# EasyEDA Pro project ProProject_aDataFlow_v2_pub_2024-01-13.epro, schematic SCH_main_2.51
Create Date: 2023-10-16; Page Name: P1; Project Name: aDataFlow_v2_pub; Schematic Name: SCH_main_2.51; Update Date: 2024-01-03; Company: AMAGSTY; Drawed: amagsty; Page Size: A3; Part Number: -; Reviewed: -; Version: 2.51
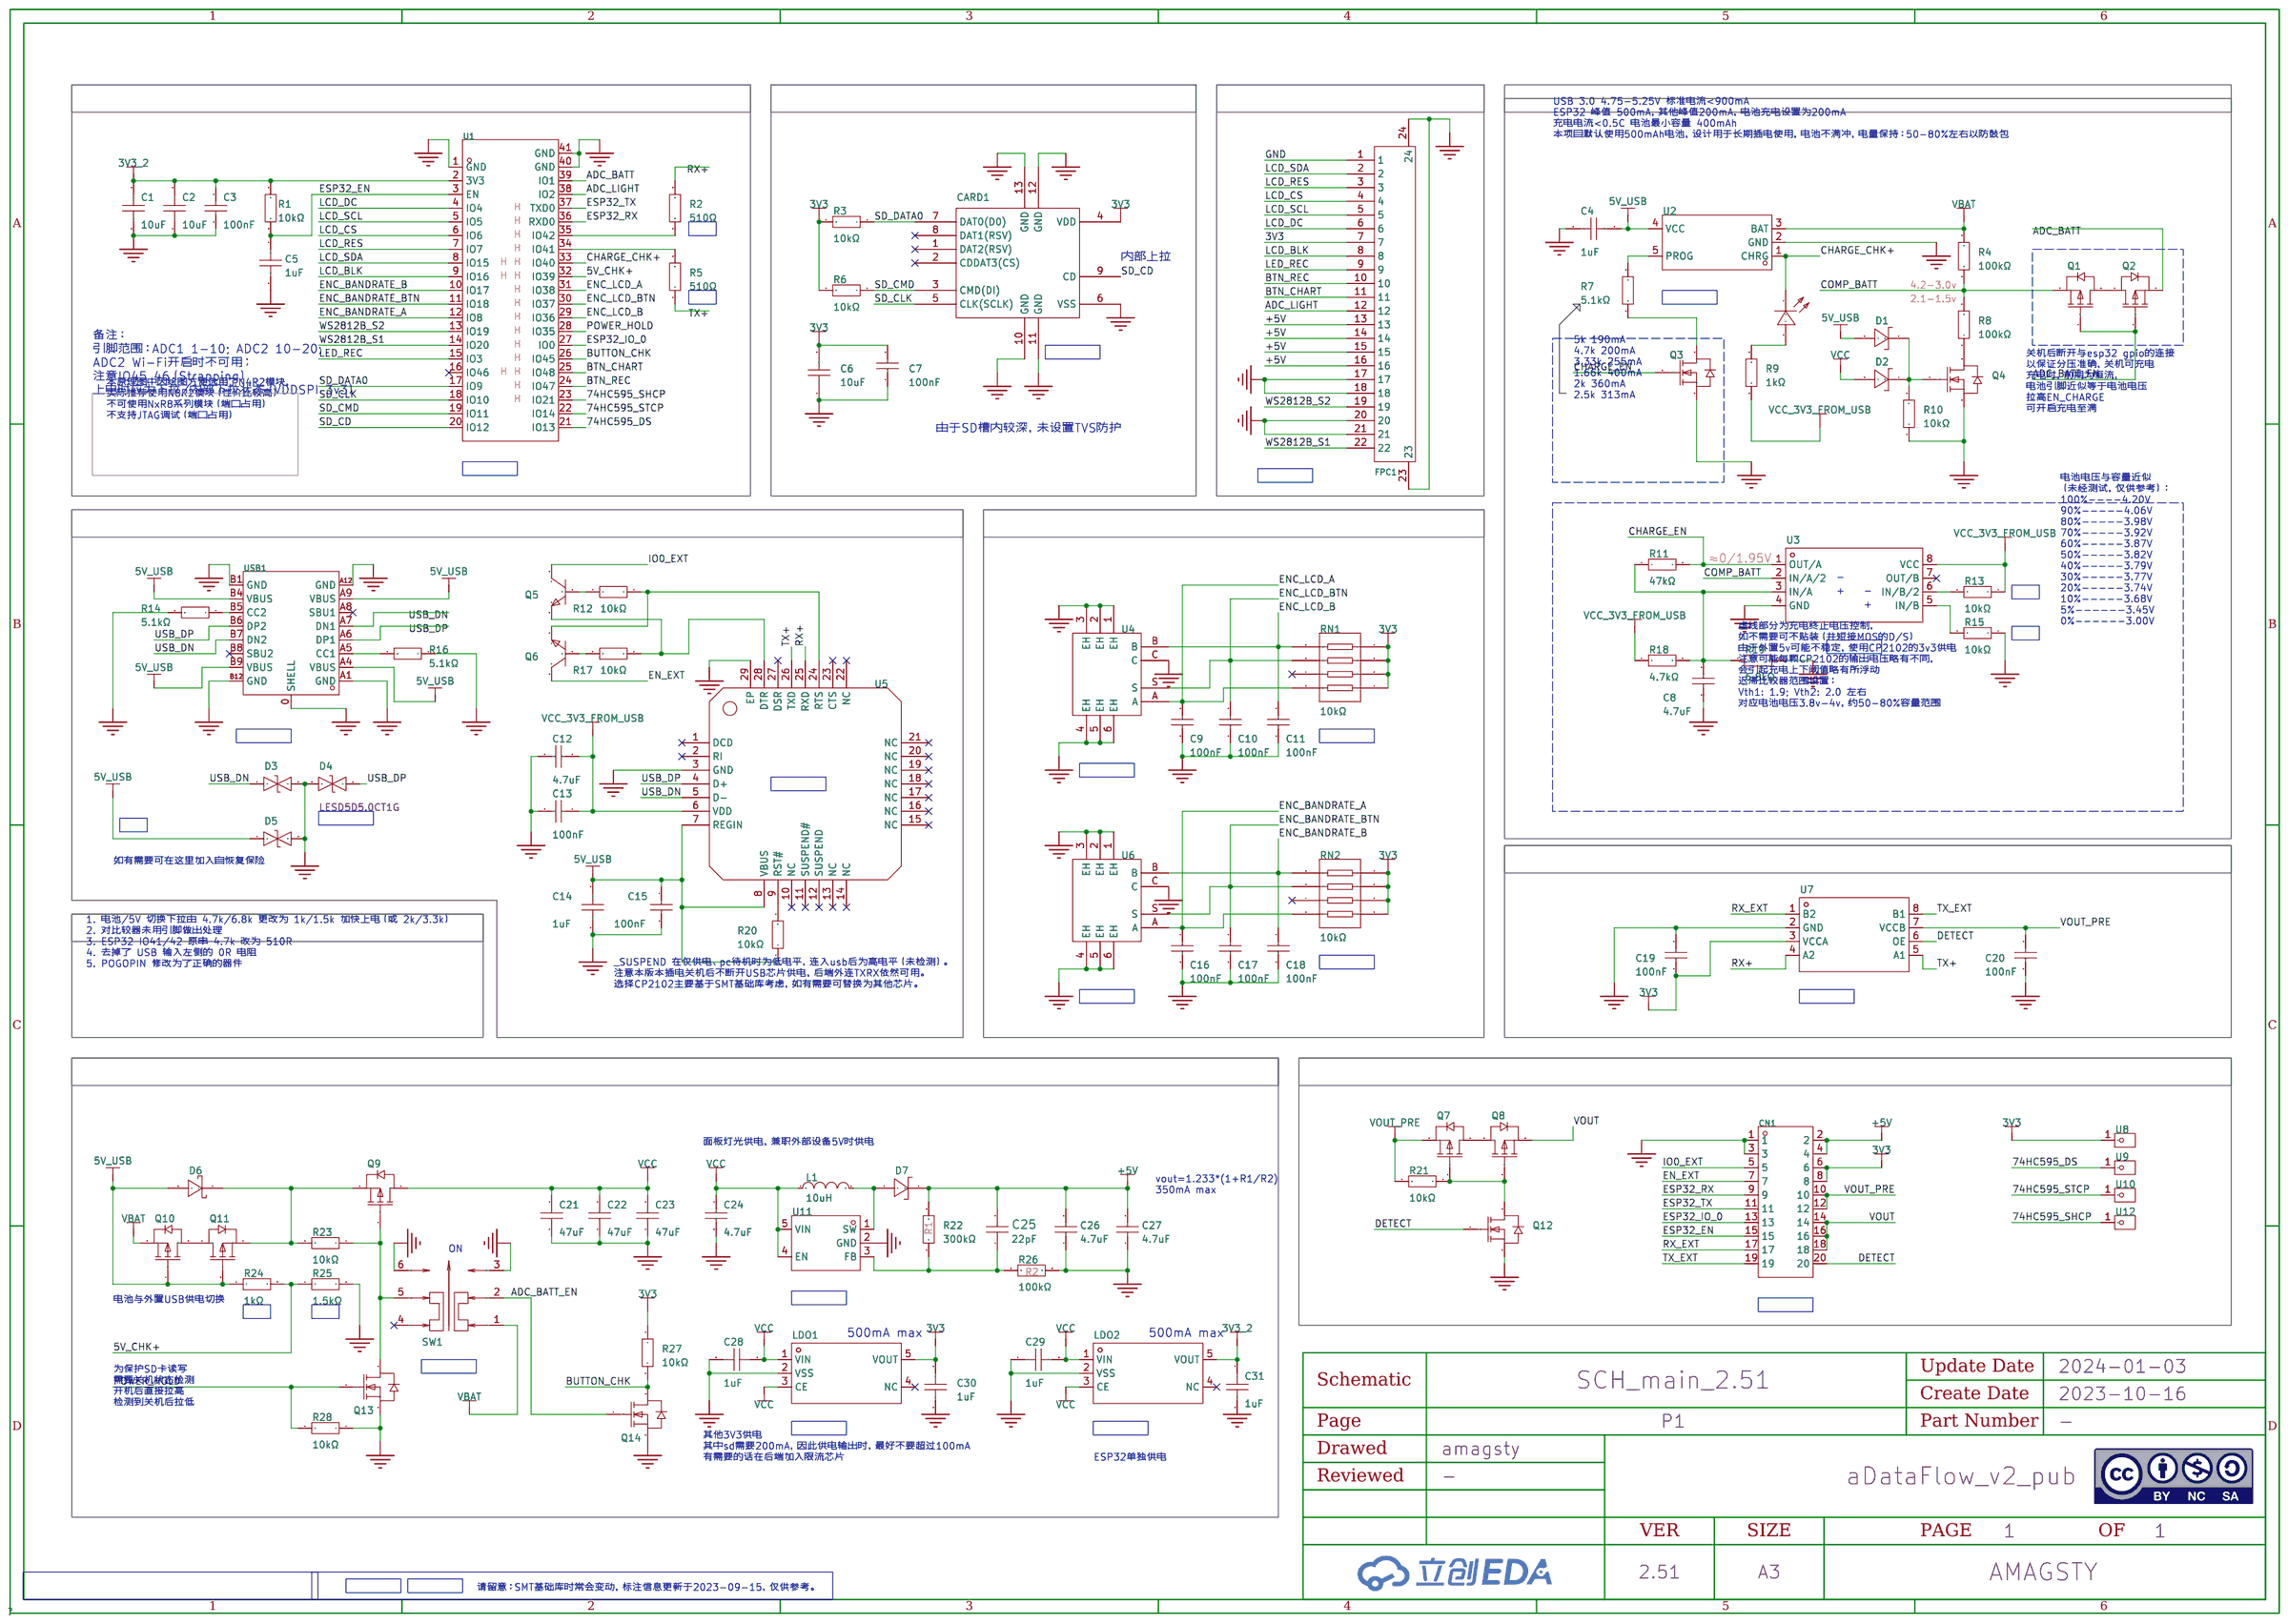
[diagram p3: schematic sheet]

## Parts
C1  10uF  [C0603]
C2  10uF  [C0603]
C3  100nF  [C0402]
C4  1uF  [C0402]
C5  1uF  [C0402]
C6  10uF  [C0603]
C7  100nF  [C0402]
C8  4.7uF  [C0402]
C9  100nF  [C0402]
C10  100nF  [C0402]
C11  100nF  [C0402]
C12  4.7uF  [C0402]
C13  100nF  [C0402]
C14  1uF  [C0402]
C15  100nF  [C0402]
C16  100nF  [C0402]
C17  100nF  [C0402]
C18  100nF  [C0402]
C19  100nF  [C0402]
C20  100nF  [C0402]
C21  47uF  [C0805]
C22  47uF  [C0805]
C23  47uF  [C0805]
C24  4.7uF  [C0402]
C25  22pF  [C0402]
C26  4.7uF  [C0402]
C27  4.7uF  [C0402]
C28  1uF  [C0402]
C29  1uF  [C0402]
C30  1uF  [C0402]
C31  1uF  [C0402]
CARD1  TF-01A  [TF-SMD_TF-01A]
CN1  X0509WVS-20AS-LPV01  [CONN-SMD_20P-P0.50_XKB_X0509WVS-20ADS-LPV01]
D1  1N5819WS  [SOD-323_L1.8-W1.3-LS2.5-RD]
D2  1N5819WS  [SOD-323_L1.8-W1.3-LS2.5-RD]
D3  LESD5D5.0CT1G  [SOD-523_L1.2-W0.8-LS1.6-BI]
D4  LESD5D5.0CT1G  [SOD-523_L1.2-W0.8-LS1.6-BI]
D5  LESD5D5.0CT1G  [SOD-523_L1.2-W0.8-LS1.6-BI]
D6  B5819W SL  [SOD-123_L2.7-W1.6-LS3.7-RD-1]
D7  1N5819WS  [SOD-323_L1.8-W1.3-LS2.5-RD]
FPC1  AFC01-S22FCA-00  [FPC-SMD_P0.5-22P_FGS-XJ-H2.0]
L1  10uH  [IND-SMD_L3.0-W3.0_SWPA3010S]
LDO1  ME6211C33M5G-N  [SOT-23-5_L3.0-W1.7-P0.95-LS2.8-BL]
LDO2  ME6211C33M5G-N  [SOT-23-5_L3.0-W1.7-P0.95-LS2.8-BL]
LED1  KT-0603R  [LED0603-RD]
Q1  AO3401A  [SOT-23_L2.9-W1.3-P1.90-LS2.4-BR]
Q2  AO3401A  [SOT-23_L2.9-W1.3-P1.90-LS2.4-BR]
Q3  AO3400A  [SOT-23-3_L2.9-W1.6-P1.90-LS2.8-BR]
Q4  AO3400A  [SOT-23-3_L2.9-W1.6-P1.90-LS2.8-BR]
Q5  SS8050  [SOT-23-3_L2.9-W1.3-P1.90-LS2.4-BR]
Q6  SS8050  [SOT-23-3_L2.9-W1.3-P1.90-LS2.4-BR]
Q7  AO3401A  [SOT-23_L2.9-W1.3-P1.90-LS2.4-BR]
Q8  AO3401A  [SOT-23_L2.9-W1.3-P1.90-LS2.4-BR]
Q9  AO3401A  [SOT-23_L2.9-W1.3-P1.90-LS2.4-BR]
Q10  AO3401A  [SOT-23_L2.9-W1.3-P1.90-LS2.4-BR]
Q11  AO3401A  [SOT-23_L2.9-W1.3-P1.90-LS2.4-BR]
Q12  AO3400A  [SOT-23-3_L2.9-W1.6-P1.90-LS2.8-BR]
Q13  AO3400A  [SOT-23-3_L2.9-W1.6-P1.90-LS2.8-BR]
Q14  AO3400A  [SOT-23-3_L2.9-W1.6-P1.90-LS2.8-BR]
R1  10kΩ  [R0402]
R2  510Ω  [R0402]
R3  10kΩ  [R0402]
R4  100kΩ  [R0402]
R5  510Ω  [R0402]
R6  10kΩ  [R0402]
R7  5.1kΩ  [R0402]
R8  100kΩ  [R0402]
R9  1kΩ  [R0402]
R10  10kΩ  [R0402]
R11  47kΩ  [R0402]
R12  10kΩ  [R0402]
R13  10kΩ  [R0402]
R14  5.1kΩ  [R0402]
R15  10kΩ  [R0402]
R16  5.1kΩ  [R0402]
R17  10kΩ  [R0402]
R18  4.7kΩ  [R0402]
R19  6.8kΩ  [R0402]
R20  10kΩ  [R0402]
R21  10kΩ  [R0402]
R22  300kΩ  [R0402]
R23  10kΩ  [R0402]
R24  1kΩ  [R0402]
R25  1.5kΩ  [R0402]
R26  100kΩ  [R0402]
R27  10kΩ  [R0402]
R28  10kΩ  [R0402]
RN1  10kΩ  [RES-ARRAY-SMD_0402-8P-L2.0-W1.0-BL]
RN2  10kΩ  [RES-ARRAY-SMD_0402-8P-L2.0-W1.0-BL]
SW1  XKB5858-Z-TP-75  [SW-SMD_6P-L5.8-W5.8-P2.00-LS8.3]
U1  ESP32-S3-WROOM-1U-N4R2  [WIRELM-SMD_ESP32-S3-WROOM-1U]
U2  TP4054-42-SOT25R  [SOT-23-5_L3.0-W1.7-P0.95-LS2.8-BL]
U3  LM393DR2G  [SOIC-8_L5.0-W4.0-P1.27-LS6.0-BL]
U4  SIQ-02FVS3  [SW-SMD_SIQ-02FVS3_1]
U5  CP2102-GMR  [WQFN-28_L5.0-W5.0-P0.50-BL-EP3.2]
U6  SIQ-02FVS3  [SW-SMD_SIQ-02FVS3_1]
U7  TXS0102DCUR  [VSON8_L2.0-W2.3-P0.50-LS3.1-BL]
U8  YTC1P-4020-01  [TESTPOINT-SMD_BD2.0_YTC1P-4020-01]
U9  YTC1P-4020-01  [TESTPOINT-SMD_BD2.0_YTC1P-4020-01]
U10  YTC1P-4020-01  [TESTPOINT-SMD_BD2.0_YTC1P-4020-01]
U11  TPS61040DBVR  [SOT-23-5_L3.0-W1.7-P0.95-LS2.8-BL]
U12  YTC1P-4020-01  [TESTPOINT-SMD_BD2.0_YTC1P-4020-01]
USB1  GT-USB-7051A  [USB-C-SMD_GT-USB-7051A]

## Library data of the parts
C1 C2 C6 = CL10A106KP8NNNC: 容值:10uF;精度:±10%;额定电压:10V;材质(温度系数):X5R;; LCSC Part Name: 10uF ±10% 10V; Supplier Part: C19702; Manufacturer: SAMSUNG(三星); Supplier Footprint: 0603; JLCPCB Part Class: 基础库; Datasheet: https://atta.szlcsc.com/upload/public/pdf/source/20160103/1457707703378.pdf; Supplier: LCSC; Tolerance: ±10%; Voltage Rated: 10V; Temperature Coefficient: X5R
C3 C7 C9-C11 C13 C15-C20 = CL05B104KO5NNNC: 容值:100nF;精度:±10%;额定电压:16V;材质(温度系数):X7R;; LCSC Part Name: 100nF ±10% 16V; Supplier Part: C1525; Manufacturer: SAMSUNG(三星); Supplier Footprint: 0402; JLCPCB Part Class: 基础库; Datasheet: https://atta.szlcsc.com/upload/public/pdf/source/20160103/1457707674891.pdf; Supplier: LCSC; Tolerance: ±10%; Voltage Rated: 16V; Temperature Coefficient: X7R
C4 C5 C14 C28-C31 = CL05A105KA5NQNC: 容值:1uF;精度:±10%;额定电压:25V;材质(温度系数):X5R;; LCSC Part Name: 1uF ±10% 25V; Supplier Part: C52923; Manufacturer: SAMSUNG(三星); Supplier Footprint: 0402; JLCPCB Part Class: 基础库; Datasheet: https://atta.szlcsc.com/upload/public/pdf/source/20160103/1457707735223.pdf; Supplier: LCSC; Tolerance: ±10%; Voltage Rated: 25V; Temperature Coefficient: X5R
C8 C12 C24 C26 C27 = CL05A475MP5NRNC: 容值:4.7uF;精度:±20%;额定电压:10V;材质(温度系数):X5R;; LCSC Part Name: 4.7uF ±20% 10V; Supplier Part: C23733; Manufacturer: SAMSUNG(三星); Supplier Footprint: 0402; JLCPCB Part Class: 基础库; Datasheet: https://atta.szlcsc.com/upload/public/pdf/source/20160103/1457707710457.pdf; Supplier: LCSC; Tolerance: ±20%; Voltage Rated: 10V; Temperature Coefficient: X5R
C21-C23 = CL21A476MQYNNNE: 容值:47uF;精度:±20%;额定电压:6.3V;材质(温度系数):X5R;; LCSC Part Name: 47uF ±20% 6.3V; Supplier Part: C16780; Manufacturer: SAMSUNG(三星); Supplier Footprint: 0805; JLCPCB Part Class: 基础库; Datasheet: https://atta.szlcsc.com/upload/public/pdf/source/20160103/1457707690276.pdf; Supplier: LCSC; Tolerance: ±20%; Voltage Rated: 6.3V; Temperature Coefficient: X5R
C25 = 0402CG220J500NT: 容值:22pF;精度:±5%;额定电压:50V;材质(温度系数):C0G;; LCSC Part Name: 22pF ±5% 50V; Supplier Part: C1555; Manufacturer: FH(风华); Supplier Footprint: 0402; JLCPCB Part Class: 基础库; Datasheet: https://atta.szlcsc.com/upload/public/pdf/source/20200305/C486355_26A10D38EF8C2A5C37091D0039909270.pdf; Supplier: LCSC; Tolerance: ±5%; Voltage Rated: 50V; Temperature Coefficient: C0G
CARD1 = TF-01A_C91145: 工作温度范围:-;本体最大高度:-;触头镀层:-;连接器类型:卡座;卡类型:MicroSD卡(TF卡);焊接温度(最大值):-;触头材质:-;卡连接方式:自弹式;; Supplier Part: C91145; Manufacturer: 韩国韩荣; Supplier Footprint: SMD; JLCPCB Part Class: 扩展库; Datasheet: https://atta.szlcsc.com/upload/public/pdf/source/20190322/C91145_63CBD6FB4639A3A3EC6A9721F18AE0FB.pdf; Supplier: LCSC; Connector Type: 卡座; Card Type: MicroSD卡(TF卡); Card Connection Mode: 自弹式
CN1 = X0509WVS-20AS-LPV01: PIN总数:20P;间距:0.5mm;行数:2;公母:公;安装方式:立贴;额定电流:3A;工作温度范围:-25℃~+85℃;; LCSC Part Name: PIN：20P 间距0.5mm 公 立贴; Supplier Part: C2925323; Manufacturer: XKB Connectivity(中国星坤); Supplier Footprint: SMD,P=0.5mm; JLCPCB Part Class: 扩展库; Datasheet: https://atta.szlcsc.com/upload/public/pdf/source/20211215/E0979017241D2013F95DF4E235DD3998.pdf; Supplier: LCSC; Number of Pins: 20P; Pitch: 0.5mm; Number of Rows: 2; Gender: 公; Mounting Style: 立贴; Current Rating (Max): 3A; Operating Temperature Range: -25℃~+85℃
D1 D2 D7 = 1N5819WS_C191023: 直流反向耐压(Vr):40V;平均整流电流(Io):1A;正向压降(Vf):600mV@1A;; LCSC Part Name: 40V 1A 600mV@1A; Supplier Part: C191023; Manufacturer: Hottech(合科泰); Supplier Footprint: SOD-323; JLCPCB Part Class: 基础库; Datasheet: https://atta.szlcsc.com/upload/public/pdf/source/20220428/3CB86FD8D28D653594B4E35F9D5AEFD9.pdf; Supplier: LCSC; Reverse Voltage (Vr): 40V; Average Rectified Current (Io): 1A; Forward Voltage (Vf@If): 600mV@1A
D3-D5 = LESD5D5.0CT1G: 极性:双向;反向截止电压(Vrwm):5V;击穿电压(VBR):5.6V;钳位电压(Vc)@Ipp:18.6V;; LCSC Part Name: 双向ESD; Supplier Part: C383211; Manufacturer: LRC(乐山无线电); Supplier Footprint: SOD-523; JLCPCB Part Class: 扩展库; Datasheet: https://atta.szlcsc.com/upload/public/pdf/source/20190807/C383211_633DF4B4E2C161403226E5235FE33A1C.pdf; Supplier: LCSC; Polarity: 双向; Reverse Stand-Off Voltage (Vrwm): 5V; Breakdown Voltage (VBR): 5.6V; Peak Pulse Current(Ipp)@8/20us: 9.4A; Clamping Voltage@Ipp: 18.6V
D6 = B5819W SL: 直流反向耐压(Vr):40V;平均整流电流(Io):1A;正向压降(Vf):600mV@1A;; LCSC Part Name: 40V 1A 600mV@1A; Supplier Part: C8598; Manufacturer: CJ(江苏长电/长晶); Supplier Footprint: SOD-123; JLCPCB Part Class: Basic Part; Datasheet: https://atta.szlcsc.com/upload/public/pdf/source/20170217/1487301580783.pdf; Supplier: LCSC; Reverse Voltage (Vr): 40V; Average Rectified Current (Io): 1A; Forward Voltage (Vf@If): 600mV@1A
FPC1 = AFC01-S22FCA-00: 间距:0.5mm;触点数量:22;锁定特性:翻盖式;安装类型:卧贴;触点类型:下接;; LCSC Part Name: FPC 0.5MM 22P 翻盖式 H2.0mm 下接; Supplier Part: C262668; Manufacturer: JS(钜硕电子); Supplier Footprint: P=0.5mm; JLCPCB Part Class: 扩展库; Supplier: LCSC; Pitch: 0.5mm; Number of Contacts: 22; Locking Feature: 翻盖式; Mounting Type: 卧贴; Contact Type: 下接; Height Above Board: 2mm; FFC, FCB Thickness: 0.3mm~0.3mm
L1 = SWPA3015S100MT: 电感值:10uH;精度:±20%;额定电流:770mA;直流电阻(DCR):325mΩ;; LCSC Part Name: 10uH ±20% 770mA 325mΩ; Supplier Part: C45403; Manufacturer: Sunlord(顺络); Supplier Footprint: SMD; JLCPCB Part Class: 扩展库; Datasheet: https://atta.szlcsc.com/upload/public/pdf/source/20210916/AC798BA7E846B7D0B6818F45CD84DB0B.pdf; Supplier: LCSC; Tolerance: ±20%; Rated Current: 770mA; DC Resistance (DCR): 325mΩ
LDO1 LDO2 = ME6211C33M5G-N: 输出类型:固定;输出极性:正;最大输入电压:6V;输出电压:3.3V;输出电流:500mA;电源纹波抑制比(PSRR):70dB;; Supplier Part: C82942; Manufacturer: MICRONE(南京微盟); Supplier Footprint: SOT-23-5; JLCPCB Part Class: Extended Part; Datasheet: https://atta.szlcsc.com/upload/public/pdf/source/20170918/C82942_1505727073070976520.pdf; Supplier: LCSC; Output Type: 固定; Output Polarity: 正; Number of Outputs: 1; Maximum Input Voltage: 6V; Output Voltage: 3.3V; Dropout Voltage: 260mV@(200mA); Output Current: 500mA; Power Supply Rejection Ratio (PSRR): 70dB
LED1 = KT-0603R: 发光颜色:红灯;二极管配置:-;透镜颜色:-;主波长:-;色温:-;功率:-;发光角度:-;安装方式:-;工作温度:-40℃~+85℃;; LCSC Part Name: 0603 红灯 高亮; Supplier Part: C2286; Manufacturer: KENTO; Supplier Footprint: 0603; JLCPCB Part Class: 基础库; Datasheet: https://atta.szlcsc.com/upload/public/pdf/source/20160616/1466072038404.pdf; Supplier: LCSC; Emitted Color: 红灯; Operating Temperature: -40℃~+85℃
Q1 Q2 Q7-Q11 = AO3401A_C15127: 类型:P沟道;漏源电压(Vdss):30V;连续漏极电流(Id):4A;功率(Pd):1.4W;导通电阻(RDS(on)@Vgs,Id):44mΩ@10V,4.3A;; LCSC Part Name: P沟道 30V 4A; Supplier Part: C15127; Manufacturer: AOS; Supplier Footprint: SOT-23-3L; JLCPCB Part Class: Basic Part; Datasheet: https://atta.szlcsc.com/upload/public/pdf/source/20160507/1462613609053.pdf; Supplier: LCSC; Type: P沟道; Drain Source Voltage (Vdss): 30V; Continuous Drain Current (Id): 4A; Power Dissipation (Pd): 1.4W; Drain Source On Resistance (RDS(on)@Vgs,Id): 44mΩ@10V,4.3A; Gate Threshold Voltage (Vgs(th)@Id): 1.3V@250uA
Q3 Q4 Q12-Q14 = AO3400A_C20917: 类型:N沟道;漏源电压(Vdss):30V;连续漏极电流(Id):5.7A;功率(Pd):1.4W;导通电阻(RDS(on)@Vgs,Id):26.5mΩ@10V,5.7A;; LCSC Part Name: N沟道 30V 5.7A; Supplier Part: C20917; Manufacturer: AOS; Supplier Footprint: SOT-23-3L; JLCPCB Part Class: Basic Part; Datasheet: https://atta.szlcsc.com/upload/public/pdf/source/20140107/1457706668533.pdf; Supplier: LCSC; Type: N沟道; Drain Source Voltage (Vdss): 30V; Continuous Drain Current (Id): 5.7A; Power Dissipation (Pd): 1.4W; Drain Source On Resistance (RDS(on)@Vgs,Id): 26.5mΩ@10V,5.7A; Gate Threshold Voltage (Vgs(th)@Id): 1.5V@250uA
Q5 Q6 = SS8050_C2150: 晶体管类型:NPN;集射极击穿电压(Vceo):25V;集电极电流(Ic):1.5A;功率(Pd):300mW;直流电流增益(hFE@Ic,Vce):200@100mA,1V;; LCSC Part Name: NPN 25V 1.5A Y1 200-350; Supplier Part: C2150; Manufacturer: CJ(江苏长电/长晶); Supplier Footprint: SOT-23; JLCPCB Part Class: 基础库; Datasheet: https://atta.szlcsc.com/upload/public/pdf/source/20230322/AEE86F4B043774EFF80CAEA14A37D9E9.pdf; Supplier: LCSC; Transistor Type: NPN; Collector-Emitter Breakdown Voltage (Vceo): 25V; Collector Current (Ic): 1.5A; Power Dissipation (Pd): 300mW; Collector Cut-Off Current (Icbo): 100nA; Collector-Emitter Saturation Voltage (VCE(sat)@Ic,Ib): 500mV@800mA,80mA; DC Current Gain (hFE@Ic,Vce): 200@100mA,1V; Transition Frequency (fT): 100MHz; Operating Temperature: +150℃@(Tj)
R1 R3 R6 R10 R12 R13 R15 R17 R20 R21 R23 R27 R28 = 0402WGF1002TCE: 电阻类型:厚膜电阻;阻值:10kΩ;精度:±1%;功率:62.5mW;; LCSC Part Name: 10kΩ ±1% 62.5mW; Supplier Part: C25744; Manufacturer: UNI-ROYAL(厚声); Supplier Footprint: 0402; JLCPCB Part Class: 基础库; Datasheet: https://atta.szlcsc.com/upload/public/pdf/source/20200306/C422600_1E6D84923E4A46A82E41ADD87F860B5C.pdf; Supplier: LCSC; Type: 厚膜电阻; Tolerance: ±1%; Power(Watts): 62.5mW; Temperature Coefficient: ±100ppm/℃; Overload Voltage (Max): 50V; Operating Temperature Range: -55℃~+155℃
R2 R5 = 0402WGF5100TCE: 阻值:510Ω;精度:±1%;功率:62.5mW;温度系数:±100ppm/℃;电阻类型:厚膜电阻;; LCSC Part Name: 510Ω ±1% 62.5mW 厚膜电阻; Supplier Part: C25123; Manufacturer: UNI-ROYAL(厚声); Supplier Footprint: 0402; JLCPCB Part Class: 基础库; Datasheet: https://atta.szlcsc.com/upload/public/pdf/source/20200306/C422600_1E6D84923E4A46A82E41ADD87F860B5C.pdf; Supplier: LCSC; Tolerance: ±1%; Power(Watts): 62.5mW; Overload Voltage (Max): 50V; Temperature Coefficient: ±100ppm/℃; Type: 厚膜电阻; Operating Temperature Range: -55℃~+155℃
R4 R8 R26 = 0402WGF1003TCE: 电阻类型:厚膜电阻;阻值:100kΩ;精度:±1%;功率:62.5mW;; LCSC Part Name: 100kΩ ±1% 62.5mW; Supplier Part: C25741; Manufacturer: UNI-ROYAL(厚声); Supplier Footprint: 0402; JLCPCB Part Class: 基础库; Datasheet: https://atta.szlcsc.com/upload/public/pdf/source/20200306/C422600_1E6D84923E4A46A82E41ADD87F860B5C.pdf; Supplier: LCSC; Type: 厚膜电阻; Tolerance: ±1%; Power(Watts): 62.5mW; Temperature Coefficient: ±100ppm/℃; Overload Voltage (Max): 50V; Operating Temperature Range: -55℃~+155℃
R7 R14 R16 = 0402WGF5101TCE: 电阻类型:厚膜电阻;阻值:5.1kΩ;精度:±1%;功率:62.5mW;; LCSC Part Name: 5.1kΩ ±1% 62.5mW; Supplier Part: C25905; Manufacturer: UNI-ROYAL(厚声); Supplier Footprint: 0402; JLCPCB Part Class: Basic Part; Datasheet: https://atta.szlcsc.com/upload/public/pdf/source/20200306/C422600_1E6D84923E4A46A82E41ADD87F860B5C.pdf; Supplier: LCSC; Type: 厚膜电阻; Tolerance: ±1%; Power(Watts): 62.5mW; Temperature Coefficient: ±100ppm/℃; Overload Voltage (Max): 50V; Operating Temperature Range: -55℃~+155℃
R9 = 0402WGF1001TCE: 电阻类型:厚膜电阻;阻值:1kΩ;精度:±1%;功率:62.5mW;; LCSC Part Name: 1kΩ ±1% 62.5mW; Supplier Part: C11702; Manufacturer: UNI-ROYAL(厚声); Supplier Footprint: 0402; JLCPCB Part Class: 基础库; Datasheet: https://atta.szlcsc.com/upload/public/pdf/source/20200306/C422600_1E6D84923E4A46A82E41ADD87F860B5C.pdf; Supplier: LCSC; Type: 厚膜电阻; Tolerance: ±1%; Power(Watts): 62.5mW; Temperature Coefficient: ±100ppm/℃; Overload Voltage (Max): 50V; Operating Temperature Range: -55℃~+155℃
R11 = 0402WGF4702TCE: 电阻类型:厚膜电阻;阻值:47kΩ;精度:±1%;功率:62.5mW;; LCSC Part Name: 47kΩ ±1% 62.5mW; Supplier Part: C25792; Manufacturer: UNI-ROYAL(厚声); Supplier Footprint: 0402; JLCPCB Part Class: 基础库; Datasheet: https://atta.szlcsc.com/upload/public/pdf/source/20200306/C422600_1E6D84923E4A46A82E41ADD87F860B5C.pdf; Supplier: LCSC; Type: 厚膜电阻; Tolerance: ±1%; Power(Watts): 62.5mW; Temperature Coefficient: ±100ppm/℃; Overload Voltage (Max): 50V; Operating Temperature Range: -55℃~+155℃
R18 = 0402WGF4701TCE: 电阻类型:厚膜电阻;阻值:4.7kΩ;精度:±1%;功率:62.5mW;; LCSC Part Name: 4.7kΩ ±1% 62.5mW; Supplier Part: C25900; Manufacturer: UNI-ROYAL(厚声); Supplier Footprint: 0402; JLCPCB Part Class: 基础库; Datasheet: https://atta.szlcsc.com/upload/public/pdf/source/20200306/C422600_1E6D84923E4A46A82E41ADD87F860B5C.pdf; Supplier: LCSC; Type: 厚膜电阻; Tolerance: ±1%; Power(Watts): 62.5mW; Temperature Coefficient: ±100ppm/℃; Overload Voltage (Max): 50V; Operating Temperature Range: -55℃~+155℃
R19 = 0402WGF6801TCE: 电阻类型:厚膜电阻;阻值:6.8kΩ;精度:±1%;功率:62.5mW;; LCSC Part Name: 6.8kΩ ±1% 62.5mW; Supplier Part: C25917; Manufacturer: UNI-ROYAL(厚声); Supplier Footprint: 0402; JLCPCB Part Class: 基础库; Datasheet: https://atta.szlcsc.com/upload/public/pdf/source/20200306/C422600_1E6D84923E4A46A82E41ADD87F860B5C.pdf; Supplier: LCSC; Type: 厚膜电阻; Tolerance: ±1%; Power(Watts): 62.5mW; Temperature Coefficient: ±100ppm/℃; Overload Voltage (Max): 50V; Operating Temperature Range: -55℃~+155℃
R22 = 0402WGF3003TCE: 电阻类型:厚膜电阻;阻值:300kΩ;精度:±1%;功率:62.5mW;; LCSC Part Name: 300kΩ ±1% 62.5mW; Supplier Part: C25774; Manufacturer: UNI-ROYAL(厚声); Supplier Footprint: 0402; JLCPCB Part Class: 基础库; Datasheet: https://atta.szlcsc.com/upload/public/pdf/source/20200306/C422600_1E6D84923E4A46A82E41ADD87F860B5C.pdf; Supplier: LCSC; Type: 厚膜电阻; Tolerance: ±1%; Power(Watts): 62.5mW; Temperature Coefficient: ±100ppm/℃; Overload Voltage (Max): 50V; Operating Temperature Range: -55℃~+155℃
R24 = 0402WGF1001TCE: 阻值:1kΩ;精度:±1%;功率:62.5mW;温度系数:±100ppm/℃;电阻类型:厚膜电阻;; LCSC Part Name: 1kΩ ±1% 62.5mW 厚膜电阻; Supplier Part: C11702; Manufacturer: UNI-ROYAL(厚声); Supplier Footprint: 0402; JLCPCB Part Class: Basic Part; Datasheet: https://atta.szlcsc.com/upload/public/pdf/source/20200306/C422600_1E6D84923E4A46A82E41ADD87F860B5C.pdf; Supplier: LCSC; Type: 厚膜电阻; Tolerance: ±1%; Power(Watts): 62.5mW; Temperature Coefficient: ±100ppm/℃; Overload Voltage (Max): 50V; Operating Temperature Range: -55℃~+155℃
R25 = 0402WGF1501TCE: 阻值:1.5kΩ;精度:±1%;功率:62.5mW;温度系数:±100ppm/℃;电阻类型:厚膜电阻;; LCSC Part Name: 1.5kΩ ±1% 62.5mW 厚膜电阻; Supplier Part: C25867; Manufacturer: UNI-ROYAL(厚声); Supplier Footprint: 0402; JLCPCB Part Class: Basic Part; Datasheet: https://atta.szlcsc.com/upload/public/pdf/source/20200306/C422600_1E6D84923E4A46A82E41ADD87F860B5C.pdf; Supplier: LCSC; Tolerance: ±1%; Power(Watts): 62.5mW; Overload Voltage (Max): 50V; Temperature Coefficient: ±100ppm/℃; Type: 厚膜电阻; Operating Temperature Range: -55℃~+155℃
RN1 RN2 = 4D02WGJ0103TCE: 阻值:10kΩ;精度:±5%;单个元件功率:62.5mW;电阻器数:4;; LCSC Part Name: 10kΩ ±5%; Supplier Part: C25725; Manufacturer: UNI-ROYAL(厚声); Supplier Footprint: 0402x4; JLCPCB Part Class: 基础库; Datasheet: https://atta.szlcsc.com/upload/public/pdf/source/20170615/1497510998113.pdf; Supplier: LCSC; Tolerance: ±5%; Power(Watts): 62.5mW; Number of Resistors: 4; Number of Pins: 8; Temperature Coefficient: ±200ppm/℃
SW1 = XKB5858-Z-TP-75: 触点电流:100mA;额定电压 (AC):250V;额定电压 (DC):30V;绝缘电阻:100MΩ;安装方式:立贴;自锁/无锁:自锁;按键形状:方形按钮;按键/盖帽颜色:白色;带灯:无;引脚样式:SMD接片;作用力:160gf@±80gf;工作温度:-15℃~+55℃;机械寿命:100000;; LCSC Part Name: 按键开关5.8*按键开关5.8贴片自锁开关 平头; Supplier Part: C692487; Manufacturer: XKB Connectivity(中国星坤); Supplier Footprint: SMD; JLCPCB Part Class: Extended Part; Datasheet: https://atta.szlcsc.com/upload/public/pdf/source/20211011/C026329EEDA5FA5907D52CCCFB7A027C.pdf; Supplier: LCSC; Contact Current: 100mA; Voltage Rating (AC): 250V; Voltage Rating (DC): 30V; Insulation Resistance: 100MΩ; Mounting Style: 立贴; Self Lock / No Lock: 自锁; Actuator Style: 方形按钮; Actuator/Cap Color: 白色; With Lamp: 无; Pin Style: SMD接片; Operating Force: 160gf@±80gf; Operating Temperature: -15℃~+55℃; Mechanical Life: 100000
U1 = ESP32-S3-WROOM-1U-N4R2: LCSC Part Name: 通用型Wi-Fi+低功耗蓝牙MCU模组; Supplier Part: C3013942; Manufacturer: ESPRESSIF(乐鑫); Supplier Footprint: SMD,18x19.2mm; JLCPCB Part Class: Extended Part; Datasheet: https://atta.szlcsc.com/upload/public/pdf/source/20220628/A2AC12B3C87735CAEB7EBE2DBE80936C.pdf; Supplier: LCSC
U2 = TP4054-42-SOT25R: 锂电池充电管理芯片; Supplier Part: C32574; Manufacturer: TOPPOWER(南京拓微); Supplier Footprint: SOT-23-5; JLCPCB Part Class: Basic Part; Datasheet: https://atta.szlcsc.com/upload/public/pdf/source/20140621/1457707095588.pdf; Supplier: LCSC
U3 = LM393DR2G: 比较器组数:2;输入失调电压(Vos):5mV;输入偏置电流(Ib):250nA;; LCSC Part Name: 比较器，双，低偏移电压; Supplier Part: C7955; Manufacturer: onsemi(安森美); Supplier Footprint: SOIC-8; JLCPCB Part Class: 基础库; Datasheet: https://atta.szlcsc.com/upload/public/pdf/source/20140815/1457707223499.pdf; Supplier: LCSC; Number of Elements: 2; Input Offset Voltage (Vos): 5mV; Input Bias Current (Ib): 250nA; Supply Current: 2.5mA; Supply Voltage: 1V~18V；2V~36V; Operating Temperature: 0℃~+70℃
U4 U6 = SIQ-02FVS3: LCSC Part Name: 拨轮滚轮旋转编码器开关; Supplier Part: C2925423; Manufacturer: MITSUMI(美上美); Supplier Footprint: SMD; JLCPCB Part Class: Extended Part; Datasheet: https://atta.szlcsc.com/upload/public/pdf/source/20220728/2FBC1A98A06DC86460FC69DAE20456FC.pdf; Supplier: LCSC
U5 = CP2102-GMR: 类型:Transceiver;协议类别:USB;驱动器/接收器数:1/1;数据速率:1Mbps;; Supplier Part: C6568; Manufacturer: SILICON LABS(芯科); Supplier Footprint: QFN-28(5x5); JLCPCB Part Class: 基础库; Datasheet: https://atta.szlcsc.com/upload/public/pdf/source/20170103/1483439882795.pdf; Supplier: LCSC; Type: Transceiver; Protocol: USB; Number of Drivers/Receivers: 1/1; Data Rate: 1Mbps; Supply Voltage: 3V ~ 3.6V
U7 = TXS0102DCUR: 通道数:2;电压(VCCA):1.65V~3.6V;电压(VCCB):2.3V~5.5V;数据速率:24Mbps;; Supplier Part: C53434; Manufacturer: TI(德州仪器); Supplier Footprint: VSSOP-8; JLCPCB Part Class: Extended Part; Datasheet: https://atta.szlcsc.com/upload/public/pdf/source/20150713/1457707330008.pdf; Supplier: LCSC; Channel Type: 双向; Number of Channels: 2; Supply Voltage (VCCA): 1.65V~3.6V; Supply Voltage (VCCB): 2.3V~5.5V; Output Type: 开路漏极，推挽式; Data Rate: 24Mbps; Operating Temperature: -40℃~+85℃; Features: 自动方向检测
U8-U10 U12 = YTC1P-4020-01: 类型:弹簧顶针(POGO PIN);PIN位数:单PIN位;全长/全高:6mm;额定电流:2.5A;额定电压:12V;触头材质:黄铜;触头镀层:金;; LCSC Part Name: POGO PIN弹簧顶针 贴片连接器; Supplier Part: C5221284; Manufacturer: YIYUAN(怡远); JLCPCB Part Class: Extended Part; Datasheet: https://atta.szlcsc.com/upload/public/pdf/source/20221031/BD070516233C1C93A35D01CFB419D0D5.pdf; Supplier: LCSC; Type: 弹簧顶针(POGO PIN); Number of Pins: 单PIN位; Overall Length/Height: 6mm; Rated Current: 2.5A; Rated Voltage: 12V; Contact Material: 黄铜; Contact Plating: 金
U11 = TPS61040DBVR: 功能类型:升压型;输入电压:1.8V~6V;输出电压:28V;输出电流(最大值):350mA;; LCSC Part Name: 升压型 输入1.8V~6V 输出28V 350mA; Supplier Part: C7722; Manufacturer: TI(德州仪器); Supplier Footprint: SOT-23-5; JLCPCB Part Class: Basic Part; Datasheet: https://atta.szlcsc.com/upload/public/pdf/source/20140704/1457707110339.pdf; Supplier: LCSC; Function: 升压型; Synchronous Rectification: 否; Number of Outputs: 1; Topology: 升压式; Input Voltage: 1.8V~6V; Output Voltage: 28V; Output Current (Max): 350mA; Switching Frequency: 1MHz
USB1 = GT-USB-7051A: 连接器类型:Type-C;标准:USB 2.0;公母:母座;触点数量:16P;端口数量:1;安装方式:立贴;额定电流 - 电源:5A;触头材质:高导铜;触头镀层:金;工作温度范围:-40℃~+85℃;; LCSC Part Name: Type-C 母座 立贴; Supplier Part: C2843970; Manufacturer: G-Switch(品赞); Supplier Footprint: SMD; JLCPCB Part Class: 扩展库; Datasheet: https://atta.szlcsc.com/upload/public/pdf/source/20210708/C2843970_57A99E08470C2FD0100D7CD4530FE18A.pdf; Supplier: LCSC; Connector Type: Type-C; Standard: USB 2.0; Gender: 母座; Number of Contacts: 16P; Number of Ports: 1; Mounting Style: 立贴; Current Rating - Power (Max): 5A; Contact Material: 高导铜; Contact Plating: 金; Operating Temperature Range: -40℃~+85℃

## Nets
3V3: C6.2 C7.2 C19.1 C30.2 CARD1.4(VDD) CN1.6 CN1.8 FPC1.7 LDO1.5(VOUT) R3.2 R6.2 R27.1 RN1.1 RN1.2 RN1.3 RN1.4 RN2.1 RN2.2 RN2.3 RN2.4 U7.3(VCCA) U8.1
3V3_2: C1.2 C2.2 C3.2 C31.2 LDO2.5(VOUT) R1.2 U1.2(3V3)
5V_CHK+: R24.2 R25.1 U1.32(IO39)
5V_USB: C4.2 C14.1 C15.1 D1.2(A) D5.1 D6.2(+) Q10.1(G) Q11.1(G) R20.1 R24.1 U2.4(VCC) U5.7(REGIN) U5.8(VBUS) USB1.A4(VBUS) USB1.A9(VBUS) USB1.B4(VBUS) USB1.B9(VBUS)
+5V: C25.2 C26.2 C27.2 CN1.2 CN1.4 D7.1(C) FPC1.13 FPC1.14 FPC1.15 FPC1.16 R22.2
GND: C1.1 C2.1 C3.1 C4.1 C5.2 C6.1 C7.1 C8.2 C9.2 C10.2 C11.2 C12.2 C13.2 C14.2 C15.2 C16.2 C17.2 C18.2 C19.2 C20.1 C21.1 C22.1 C23.1 C24.1 C26.1 C27.1 C28.2 C29.2 C30.1 C31.1 CARD1.6(VSS) CARD1.10(GND) CARD1.11(GND) CARD1.12(GND) CARD1.13(GND) CN1.1 CN1.3 D3.2 D4.2 D5.2 FPC1.1 FPC1.17 FPC1.18 FPC1.20 FPC1.21 FPC1.23 FPC1.24 LDO1.2(VSS) LDO2.2(VSS) Q3.2(S) Q4.2(S) Q12.2(S) Q13.2(S) Q14.2(S) R10.1 R14.2 R15.1 R16.1 R19.2 R25.2 R26.2 R28.1 SW1.3 SW1.6 U1.1(GND) U1.40(GND) U1.41(GND) U2.2(GND) U3.4(GND) U4.1(EH) U4.2(EH) U4.3(EH) U4.4(EH) U4.5(EH) U4.6(EH) U4.C U5.3(GND) U5.29(EP) U6.1(EH) U6.2(EH) U6.3(EH) U6.4(EH) U6.5(EH) U6.6(EH) U6.C U7.2(GND) U11.2(GND) USB1.0(SHELL) USB1.A1(GND) USB1.A12(GND) USB1.B1(GND) USB1.B12(GND)
VBAT: Q10.2(S) R4.2 SW1.1 U2.3(BAT)
VCC: C21.2 C22.2 C23.2 C24.2 C28.1 C29.1 D2.2(A) L1.1 LDO1.1(VIN) LDO1.3(CE) LDO2.1(VIN) LDO2.3(CE) Q9.3(D) U11.4(EN) U11.5(VIN)
VCC_3V3_FROM_USB: C12.1 C13.1 R9.1 R13.1 R18.1 U3.8(VCC) U5.6(VDD)
74HC595_DS: U1.21(IO13) U9.1
74HC595_SHCP: U1.23(IO21) U12.1
74HC595_STCP: U1.22(IO14) U10.1
ADC_BATT: Q2.2(S) U1.39(IO1)
ADC_BATT_EN: Q1.1(G) Q2.1(G) Q14.1(G) SW1.2
ADC_LIGHT: FPC1.12 U1.38(IO2)
BTN_CHART: FPC1.11 U1.25(IO48)
BTN_REC: FPC1.10 U1.24(IO47)
BUTTON_CHK: Q14.3(D) R27.2 U1.26(IO45)
CHARGE_CHK+: LED1.1(K) U1.33(IO40) U2.1(CHRG)
CHARGE_EN: Q3.1(G) R11.2 U3.1(OUT/A)
COMP_BATT: Q1.2(S) R4.1 R8.2 U3.2(IN/A/2)
DETECT: CN1.20 Q12.1(G) U7.6(OE)
EN_EXT: CN1.7 Q6.3(C)
ENC_BANDRATE_A: C16.1 RN2.8 U1.12(IO8) U6.A
ENC_BANDRATE_B: C18.1 RN2.5 U1.10(IO17) U6.B
ENC_BANDRATE_BTN: C17.1 RN2.6 U1.11(IO18) U6.S
ENC_LCD_A: C9.1 RN1.8 U1.31(IO38) U4.A
ENC_LCD_B: C11.1 RN1.5 U1.29(IO36) U4.B
ENC_LCD_BTN: C10.1 RN1.6 U1.30(IO37) U4.S
ESP32_EN: C5.1 CN1.15 R1.1 U1.3(EN)
ESP32_IO_0: CN1.13 U1.27(IO0)
ESP32_RX: CN1.9 U1.36(RXD0)
ESP32_TX: CN1.11 U1.37(TXD0)
IO0_EXT: CN1.5 Q5.3(C)
LCD_BLK: FPC1.8 U1.9(IO16)
LCD_CS: FPC1.4 U1.6(IO6)
LCD_DC: FPC1.6 U1.4(IO4)
LCD_RES: FPC1.3 U1.7(IO7)
LCD_SCL: FPC1.5 U1.5(IO5)
LCD_SDA: FPC1.2 U1.8(IO15)
LED_REC: FPC1.9 U1.15(IO3)
POWER_HOLD: Q13.1(G) R28.2 U1.28(IO35)
RX+: R2.2 U5.25(RXD) U7.4(A2)
RX_EXT: CN1.17 U7.1(B2)
SD_CD: CARD1.9(CD) U1.20(IO12)
SD_CLK: CARD1.5(CLK(SCLK)) U1.18(IO10)
SD_CMD: CARD1.3(CMD(DI)) R6.1 U1.19(IO11)
SD_DATA0: CARD1.7(DAT0(D0)) R3.1 U1.17(IO9)
TX+: R5.1 U5.26(TXD) U7.5(A1)
TX_EXT: CN1.19 U7.8(B1)
USB_DN: D3.1 U5.5(D-) USB1.A7(DN1) USB1.B7(DN2)
USB_DP: D4.1 U5.4(D+) USB1.A6(DP1) USB1.B6(DP2)
VOUT: CN1.14 CN1.16 CN1.18 Q8.2(S)
VOUT_PRE: C20.2 CN1.10 CN1.12 Q7.2(S) R21.2 U7.7(VCCB)
WS2812B_S1: FPC1.22 U1.14(IO20)
WS2812B_S2: FPC1.19 U1.13(IO19)
$1N2499: D6.1(-) Q9.2(S) Q11.2(S) R23.2
$1N3893: Q10.3(D) Q11.3(D)
$1N5725: D7.2(A) L1.2 U11.1(SW)
$1N6186: C25.1 R22.1 R26.1 U11.3(FB)
$1N7254: R16.2 USB1.A5(CC1)
$1N7256: R14.1 USB1.B5(CC2)
$1N10499: R20.2 U5.9(RST#)
$1N15423: R7.1 U2.5(PROG)
$1N15424: Q3.3(D) R7.2
$1N23843: Q7.3(D) Q8.3(D)
$1N23847: Q7.1(G) Q8.1(G) Q12.3(D) R21.1
$1N56207: LED1.2(A) R9.2
$1N89822: Q6.1(B) R17.2
$1N89861: Q5.1(B) R12.2
$1N92628: Q6.2(E) R12.1 U5.24(RTS)
$1N98999: Q1.3(D) Q2.3(D)
$1N99171: D1.1(C) D2.1(C) Q4.1(G) R10.2
$1N99677: C8.1 R11.1 R18.2 R19.1 U3.3(IN/A)
$1N111675: R2.1 U1.35(IO42)
$1N111682: R5.2 U1.34(IO41)
$1N112671: Q9.1(G) Q13.3(D) R23.1 SW1.5
$1N115808: Q5.2(E) R17.1 U5.28(DTR)
$1N118922: Q4.3(D) R8.1
$1N142909: R13.2 U3.6(IN/B/2)
$1N142912: R15.2 U3.5(IN/B)

Not connected (* = marked no-connect by the designer): CARD1 1(DAT2(RSV))* 2(CDDAT3(CS))* 8(DAT1(RSV))*; LDO1 4(NC)*; LDO2 4(NC)*; RN1 7*; RN2 7*; SW1 4*; U1 16(IO46)*; U3 7(OUT/B)*; U5 1(DCD)* 2(RI)* 10(NC)* 11(SUSPEND#)* 12(SUSPEND)* 13(NC)* 14(NC)* 15(NC)* 16(NC)* 17(NC)* 18(NC)* 19(NC)* 20(NC)* 21(NC)* 22(NC)* 23(CTS)* 27(DSR)*; USB1 A8(SBU1)* B8(SBU2)*

## Notes on the sheet
- ESP32_S3
- SDCARD
- FPC
- BATT
- USB 3.0 4.75-5.25V 标准电流<900mA
  ESP32 峰值 500mA，其他峰值200mA，电池充电设置为200mA
  充电电流<0.5C 电池最小容量 400mAh
  本项目默认使用500mAh电池，设计用于长期插电使用，电池不满冲，电量保持：50-80%左右以防鼓包
- H
- H
- H
- NEW
- H
- H
- H
- 内部上拉
- H
- H
- H
- 4.2-3.0v
- H
- NEW
- SMT_BASE
- 2.1-1.5v
- H
- 备注：
  引脚范围：ADC1 1-10; ADC2 10-20;
  ADC2 Wi-Fi开启时不可用；
  注意IO45 46（Strapping）
  上电时应为下拉/内部下拉状态（VDDSPI 3v3）
- H
- H
- SMT_EXT
- H
- H
- H
- H
- H
- 5k 190mA
  4.7k 200mA
  3.33k 255mA
  1.66k 400mA
  2k 360mA
  2.5k 313mA
- 本原理图中因绘图方便选用了N4R2模块，
  实际推荐使用N8R2模块（性价比较高）
  不可使用NxR8系列模块（端口占用）
  不支持JTAG调试（端口占用）
- 关机后断开与esp32 gpio的连接
  以保证分压准确，关机可充电
  充电时，前期为恒流，
  电池引脚近似等于电池电压
  拉高EN_CHARGE
  可开启充电至满
- 由于SD槽内较深，未设置TVS防护
- SMT_EXT
- SMT_EXT
- CONN_USB
- ENCODERS
- ≈0/1.95V
- -
- +
- -
- NEW
- +
- 电池电压与容量近似
  （未经测试，仅供参考）：
  100%----4.20V
  90%-----4.06V
  80%-----3.98V
  70%-----3.92V
  60%-----3.87V
  50%-----3.82V
  40%-----3.79V
  30%-----3.77V
  20%-----3.74V
  10%-----3.68V
  5%------3.45V
  0%------3.00V
- SMT_BASE
- NEW
- 虚线部分为充电终止电压控制，
  如不需要可不贴装（并短接MOS的D/S）
  由于外置5v可能不稳定，使用CP2102的3v3供电
  注意可能每颗CP2102的输出电压略有不同，
  会引起充电上下阈值略有所浮动
  迟滞比较器范围设置：
  Vth1: 1.9; Vth2: 2.0 左右
  对应电池电压3.8v-4v，约50-80%容量范围
- SMT_EXT
- SMT_BASE
- SMT_EXT
- SMT_BASE
- NEW
- SMT_EXT
- 如有需要可在这里加入自恢复保险
- VOL TRANSLATOR
- UPDATE REV. 2.51
- 1. 电池/5V 切换下拉由 4.7k/6.8k 更改为 1k/1.5k 加快上电（或 2k/3.3k）
  2. 对比较器未用引脚做出处理
  3. ESP32 IO41/42 原串 4.7k 改为 510R
  4. 去掉了 USB 输入左侧的 0R 电阻
  5. POGOPIN 修改为了正确的器件
- SMT_BASE
- _SUSPEND 在仅供电、pc待机时为低电平，连入usb后为高电平（未检测）。
  注意本版本插电关机后不断开USB芯片供电，后端外连TXRX依然可用。
  选择CP2102主要基于SMT基础库考虑，如有需要可替换为其他芯片。
- SMT_EXT
- SMT_EXT
- POWER
- B2B
- 面板灯光供电，兼职外部设备5V时供电
- vout=1.233*(1+R1/R2)
  350mA max
- R1
- ON
- R2
- 电池与外置USB供电切换
- NEW
- NEW
- SMT_BASE
- SMT_EXT
- 500mA max
- 500mA max
- SMT_EXT
- 为保护SD卡读写
  需要关机状态检测
  开机后直接拉高
  检测到关机后拉低
- SMT_EXT
- SMT_EXT
- 其他3V3供电
  其中sd需要200mA，因此供电输出时，最好不要超过100mA
  有需要的话在后端加入限流芯片
- ESP32单独供电
- SMT_BASE
- SMT_EXT
- PCB: 绿色/黑色，1.2mm
- 请留意：SMT基础库时常会变动，标注信息更新于2023-09-15，仅供参考。
